# EAGLE design ATXDistributorBoard_ATM (EAGLE 7.4.0)
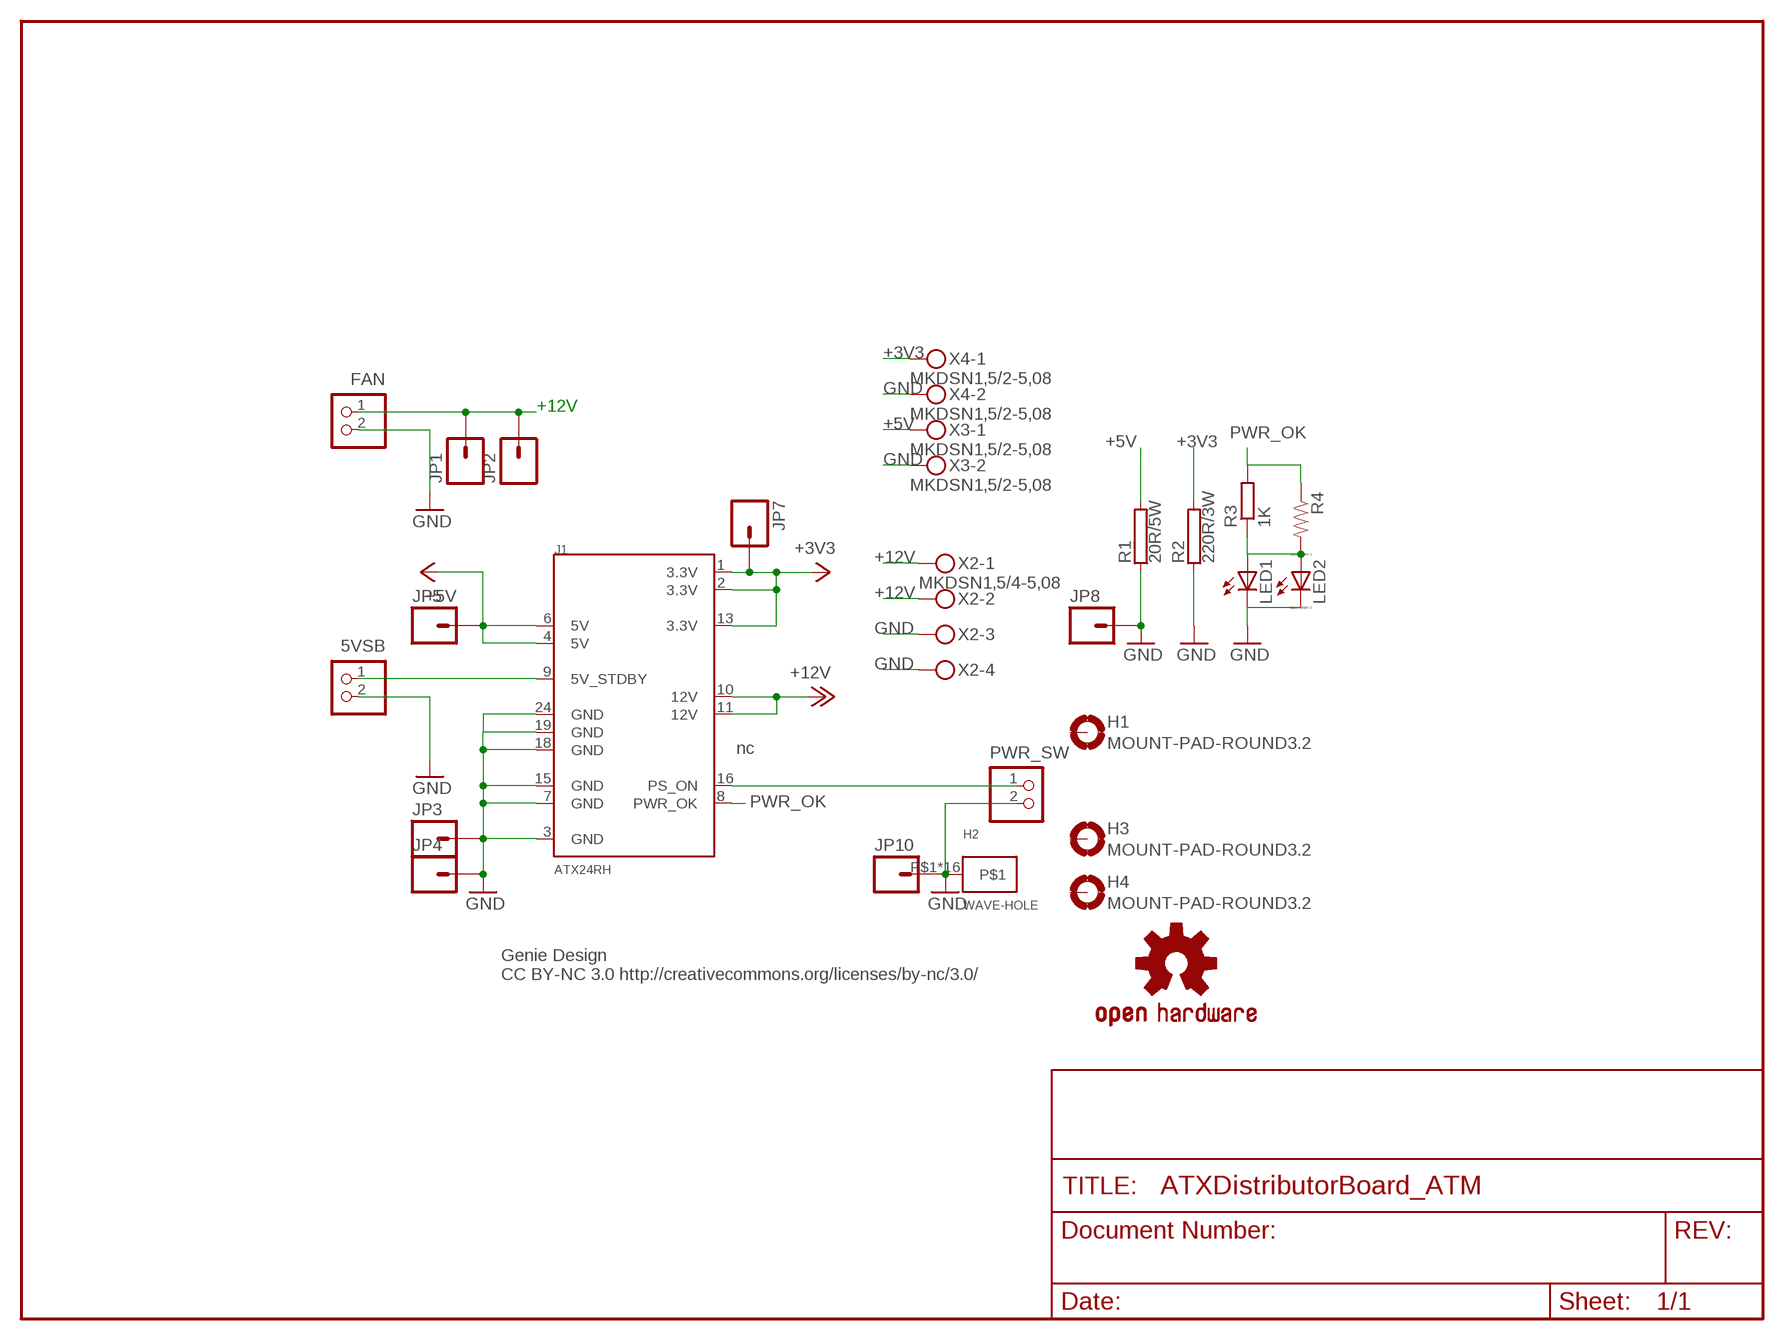
[diagram p0: schematic, sheet 1]

## Parts
5VSB  B2B-XH-A  [B2B-XH-A]
FAN  B2B-XH-A  [B2B-XH-A]
H1  MOUNT-PAD-ROUND3.2  [3,2-PAD]
H2  WAVE-HOLE  [3,0-WAVE-HOLE]
H3  MOUNT-PAD-ROUND3.2  [3,2-PAD]
H4  MOUNT-PAD-ROUND3.2  [3,2-PAD]
J1  ATX24RH  [ATX24_RIGHT_ANGLE]
JP1  M01PTH_NO_SILK_YES_STOP  [1X01_NO_SILK]
JP2  M01PTH_NO_SILK_YES_STOP  [1X01_NO_SILK]
JP3  M01PTH_NO_SILK_YES_STOP  [1X01_NO_SILK]
JP4  M01PTH_NO_SILK_YES_STOP  [1X01_NO_SILK]
JP5  M01PTH_NO_SILK_YES_STOP  [1X01_NO_SILK]
JP7  M01PTH_NO_SILK_YES_STOP  [1X01_NO_SILK]
JP8  M01PTH_NO_SILK_YES_STOP  [1X01_NO_SILK]
JP10  M01PTH_NO_SILK_YES_STOP  [1X01_NO_SILK]
LED1  LED3MM  [LED3MM]
LED2  LED_ESML0603  [LED_SML0603]
LOGO1  OSHW-LOGOS-COPPER  [OSHW-LOGO-S_COPPER]
PWR_SW  B2B-XH-A  [B2B-XH-A]
R1  20R/5W  RHPS923  [HPS923]
R2  220R/3W  RCA4050  [CA4050]
R3  1K  R-EU_0207/10  [0207/10]
R4  RESISTOR0603-RES  [0603-RES]
X2  MKDSN1,5/4-5,08  [MKDSN1,5/4-5,08]
X3  MKDSN1,5/2-5,08  [MKDSN1,5/2-5,08]
X4  MKDSN1,5/2-5,08  [MKDSN1,5/2-5,08]

## Nets
5VSB: 5VSB.1 J1.9(5V_STDBY)
+3V3: J1.1(3.3V) J1.2(3.3V) J1.13(3.3V) JP7.1 R2.2 X4.1
+5V: J1.4(5V) J1.6(5V) JP5.1 R1.2 X3.1
+12V: FAN.1 J1.10(12V) J1.11(12V) JP1.1 JP2.1 X2.1 X2.2
GND: 5VSB.2 FAN.2 H2.P$1 H2.P$2 H2.P$3 H2.P$4 H2.P$5 H2.P$6 H2.P$7 H2.P$8 H2.P$17 H2.P$18 H2.P$19 H2.P$20 H2.P$21 H2.P$22 H2.P$23 H2.P$24 J1.3(GND) J1.7(GND) J1.15(GND) J1.18(GND) J1.19(GND) J1.24(GND) JP3.1 JP4.1 JP8.1 JP10.1 LED1.K(C) LED2.C PWR_SW.2 R1.1 R2.1 X2.3 X2.4 X3.2 X4.2
N$2: LED1.A LED2.A R3.1 R4.2
PS_ON: J1.16(PS_ON) PWR_SW.1
PWR_OK: J1.8(PWR_OK) R3.2 R4.1
Unconnected: H1.B3,2(MOUNT) H3.B3,2(MOUNT) H4.B3,2(MOUNT)

## Notes on the sheet
- +12V
- nc
- Genie Design
  CC BY-NC 3.0 http://creativecommons.org/licenses/by-nc/3.0/

## Library data of the parts
5VSB FAN PWR_SW = jst-xh:B2B-XH-A: Wire-to-Board 2.5mm pitch top mount connector Source: http://www.jst-mfg.com/product/pdf/jpn/XH.pdf http://www.jst-mfg.com/product/detail.php?series=277
H1 H3 H4 = holes:MOUNT-PAD-ROUND: MOUNTING PAD, round
H2 = ultimachine:WAVE-HOLE
J1 = SparkFun-Connectors:ATX24: ATX24 Pin Power Supply Connector This is a good connector for connecting a computer power supply to a PCB. It's massive, but provides many amps of power at 5V and 12V. SKU: PRT-09498
JP1-JP5 JP7 JP8 JP10 = SparkFun-Connectors:M01: Header 1 Standard 1-pin 0.1" header. Use with straight break away headers (SKU : PRT-00116), right angle break away headers (PRT-00553), swiss pins (PRT-00743), machine pins (PRT-00117), and female headers (PRT-00115).
LED1 = led:LED: LED OSRAM: - CHIPLED LG R971, LG N971, LY N971, LG Q971, LY Q971, LO R971, LY R971 LH N974, LH R974 LS Q976, LO Q976, LY Q976 LO Q996 - Hyper CHIPLED LW Q18S LB Q993, LB Q99A, LB R99A - SideLED LS A670, LO A670, LY A670, LG A670, LP A670 LB A673, LV A673, LT A673, LW A673 LH A674 LY A675 LS A676, LA A676, LO A676, LY A676, LW A676 LS A679, LY A679, LG A679 - Hyper Micro SIDELED® LS Y876, LA Y876, LO Y876, LY Y876 LT Y87S - SmartLED LW L88C, LW L88S LB L89C, LB L89S, LG L890 LS L89K, LO L89K, LY L89K LS L896, LA L896, LO L896, LY L896 - TOPLED LS T670, LO T670, LY T670, LG T670, LP T670 LSG T670, LSP T670, LSY T670, LOP T670, LYG T670 LG T671, LOG T671, LSG T671 LB T673, LV T673, LT T673, LW T673 LH T674 LS T676, LA T676, LO T676, LY T676, LB T676, LH T676, LSB T676, LW T676 LB T67C, LV T67C, LT T67C, LS T67K, LO T67K, LY T67K, LW E67C LS E67B, LA E67B, LO E67B, LY E67B, LB E67C, LV E67C, LT E67C LW T67C LS T679, LY T679, LG T679 LS T770, LO T770, LY T770, LG T770, LP T770 LB T773, LV T773, LT T773, LW T773 LH T774 LS E675, LA E675, LY E675, LS T675 LS T776, LA T776, LO T776, LY T776, LB T776 LHGB T686 LT T68C, LB T68C - Hyper Mini TOPLED® LB M676 - Mini TOPLED Santana® LG M470 LS M47K, LO M47K, LY M47K Source: http://www.osram.convergy.de LUXEON: - LUMILED® LXK2-PW12-R00, LXK2-PW12-S00, LXK2-PW14-U00, LXK2-PW14-V00 LXK2-PM12-R00, LXK2-PM12-S00, LXK2-PM14-U00 LXK2-PE12-Q00, LXK2-PE12-R00, LXK2-PE12-S00, LXK2-PE14-T00, LXK2-PE14-U00 LXK2-PB12-K00, LXK2-PB12-L00, LXK2-PB12-M00, LXK2-PB14-N00, LXK2-PB14-P00, LXK2-PB14-Q00 LXK2-PR12-L00, LXK2-PR12-M00, LXK2-PR14-Q00, LXK2-PR14-R00 LXK2-PD12-Q00, LXK2-PD12-R00, LXK2-PD12-S00 LXK2-PH12-R00, LXK2-PH12-S00 LXK2-PL12-P00, LXK2-PL12-Q00, LXK2-PL12-R00 Source: www.luxeon.com KINGBRIGHT: KA-3528ASYC Source: www.kingbright.com
LED2 = eagle-ltspice:LED_E: LED Source: http://www.osram.convergy.de Source: www.luxeon.com Source: www.kingbright.com; SPICEMODEL: NONE; SPICEPREFIX: D; SPICETYPE: diode
LOGO1 = SparkFun-Aesthetics:OSHW-LOGO: Open Source Hardware Logo This logo indicates the piece of hardware it is found on incorporates a OSHW license and/or adheres to the definition of open source hardware found here: http://freedomdefined.org/OSHW
R1 R2 = resistor-power:R: Power Resitor; OC_FARNELL: unknown; OC_NEWARK: unknown
R3 = resistor:R-EU_: RESISTOR, European symbol
R4 = SparkFun:RESISTOR: Resistor Basic schematic elements and footprints for 0603, 1206, and PTH resistors.
X2 = con-phoenix-508:MKDSN1,5/4-5,08: MKDSN 1,5/ 4-5,08 Printklemme Nennstrom: 13,5 A Nennspannung: 250 V Rastermaß: 5,08 mm Polzahl: 4 Anschlussart: Schraubanschluss Montage: Löten Anschlussrichtung Leiter/Platine: 0 ° Artikelnummer: 1729144 Source: http://eshop.phoenixcontact.com .. 1729144.pdf; MPN: SMKDSN1,5/4-5,08; OC_FARNELL: 1792905; OC_NEWARK: 70R0300
X3 X4 = con-phoenix-508:MKDSN1,5/2-5,08: MKDSN 1,5/ 2-5,08 Printklemme Nennstrom: 13,5 A Nennspannung: 250 V Rastermaß: 5,08 mm Polzahl: 2 Anschlussart: Schraubanschluss Montage: Löten Anschlussrichtung Leiter/Platine: 0 ° Artikelnummer: 1729128 Source: http://eshop.phoenixcontact.com .. 1729128.pdf; MPN: MKDSN 1,5/2-5.08; OC_FARNELL: 1792903; OC_NEWARK: 30M2397

## Board
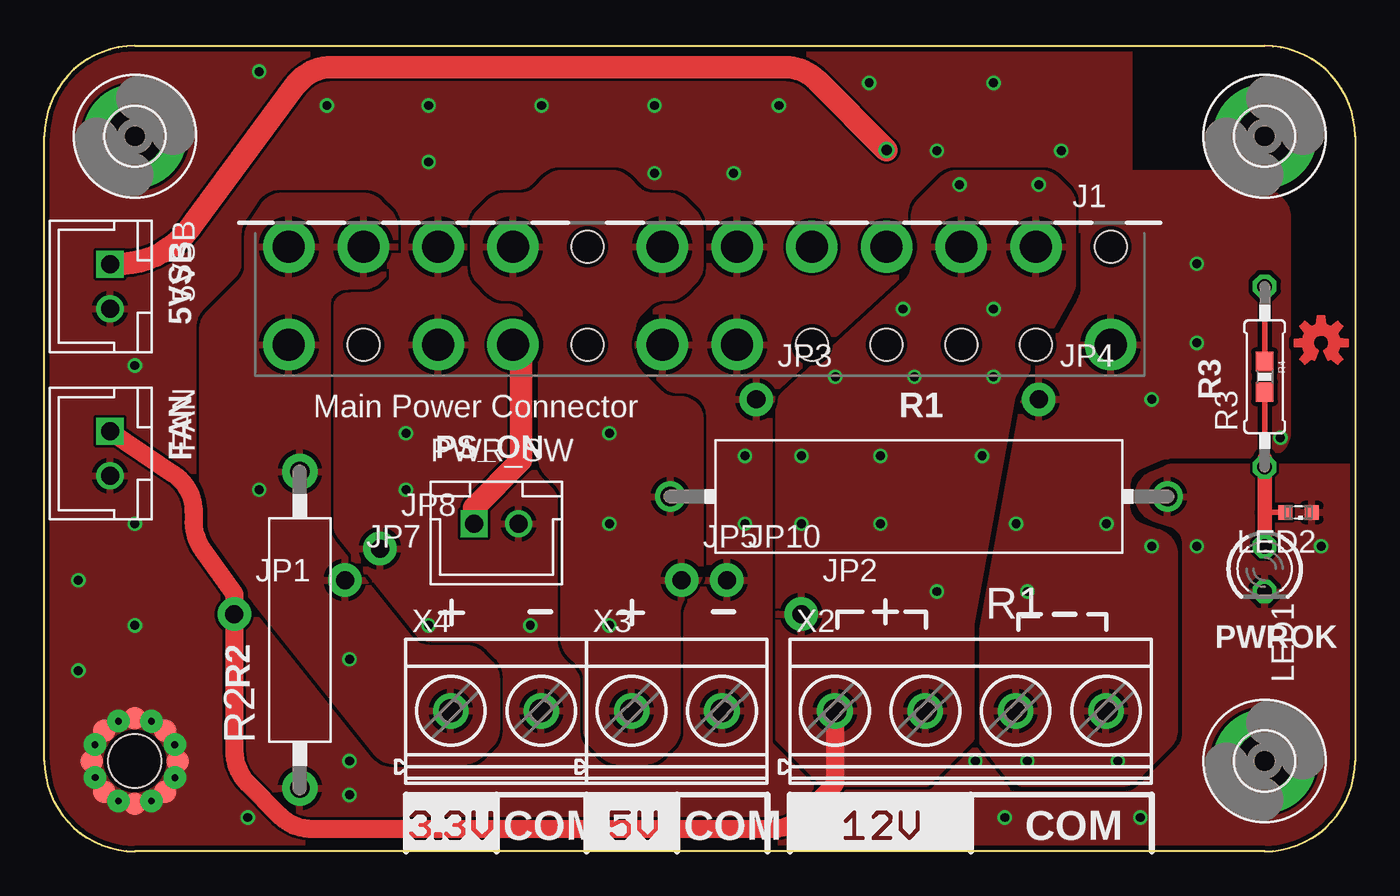
[diagram p1: board, top side]
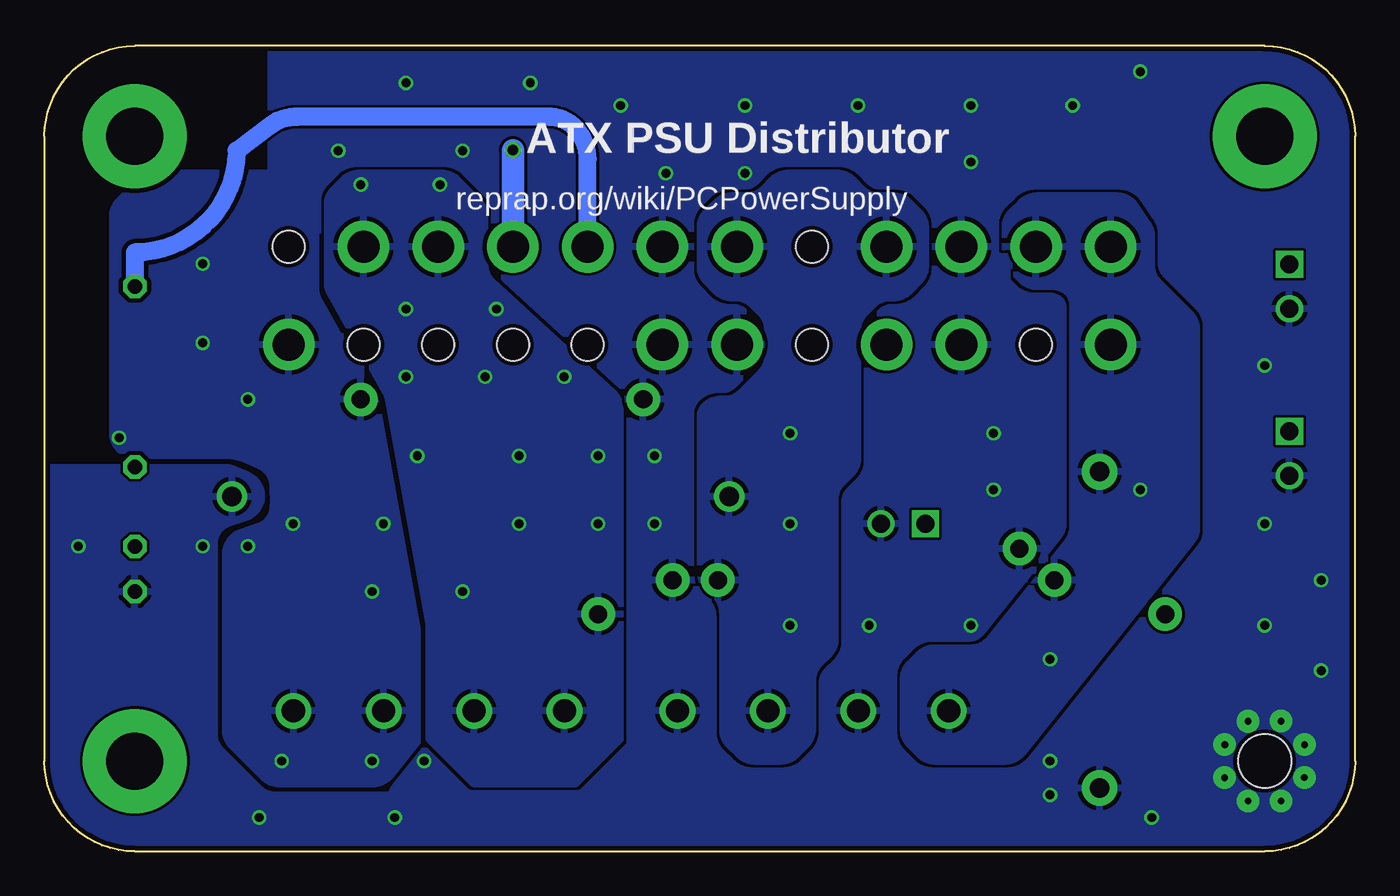
[diagram p2: board, bottom side, seen from below]

Size 73.66 x 45.26 mm. Coordinates in mm from the lower left corner, seen from the top.
Outline: 73.66,40.18 73.66,5.08 arc-90 68.58,0 5.08,0 arc-90 0,5.08 0,40.18 arc-90 5.08,45.26 68.58,45.26 arc-90 73.66,40.18
Copper layers (1*16): Top 0.035mm / dielectric 1.5mm / Bottom 0.035mm
Design rules "Elecrow_2-layer_eagle_rule": minimum track width 6mil, minimum drill 12mil, track to track 6mil, track to pad 6mil, pad to pad 6mil, via to via 6mil, smd to smd 0mil, copper to edge 10mil, drill to drill 10mil, minimum pad ring 10mil, minimum via ring 6mil, stop-mask expansion 2mil, vias tented up to drill 100mil, thermal gap 10mil

### Footprints (pad centres in the part's own frame; a part is rotated, then mirrored left to right if it is on the bottom)
B2B-XH-A = drill 1.016 square: 1 -1.25,0 | drill 1.016: 2 1.25,0
3,2-PAD = drill 3.2 pad 5.842: B3,2 0,0
3,0-WAVE-HOLE = smd 1.27 x 1.27: P$1 0,2.413; P$2 2.413,0; P$3 0,-2.413; P$4 -2.413,0; P$5 1.714,1.714; P$6 -1.714,1.714; P$7 1.714,-1.714; P$8 -1.714,-1.714 | drill 0.381 pad 1.27: P$17 -2.248,0.933; P$18 -0.927,2.242; P$19 0.921,2.242; P$20 2.235,0.927; P$21 2.242,-0.921; P$22 0.927,-2.242; P$23 -0.927,-2.235; P$24 -2.242,-0.921 | hole 3: 0,0
ATX24_RIGHT_ANGLE = drill 1.8 pad 2.9: 1 23.1,4.76; 2 18.9,4.76; 3 14.7,4.76; 4 10.5,4.76; 6 2.1,4.76; 7 -2.1,4.76; 8 -6.3,4.76; 9 -10.5,4.76; 10 -14.7,4.76; 11 -18.9,4.76; 13 23.1,10.26; 15 14.7,10.26; 16 10.5,10.26; 18 2.1,10.26; 19 -2.1,10.26; 24 -23.1,10.26 | hole 1.8: 6.3,4.76; -23.1,4.76; -18.9,10.26; -14.7,10.26; -10.5,10.26; -6.3,10.26; 6.3,10.26; 18.9,10.26
1X01_NO_SILK = drill 1.016 pad 1.88: 1 0,0
LED3MM = drill 0.813 octagon: A -1.27,0; K 1.27,0
LED_SML0603 = smd 0.8 x 0.8: A 0.75,0; C -0.75,0
HPS923 = drill 1.1 pad 1.7: 1 -13.97,0; 2 13.97,0
CA4050 = drill 1.1 pad 2: 1 -8.89,0; 2 8.89,0
0207/10 = drill 0.813 octagon: 1 -5.08,0; 2 5.08,0
0603-RES = smd 1.1 x 1: 1 -0.85,0; 2 0.85,0
MKDSN1,5/4-5,08 = drill 1.3 pad 2: 1 -7.641,0.025; 2 -2.561,0.025; 3 2.519,0.025; 4 7.599,0.025
MKDSN1,5/2-5,08 = drill 1.3 pad 2: 1 -2.561,0.025; 2 2.519,0.025

### Placement (x,y rotation side)
5VSB  3.68,31.75 270 top
FAN  3.68,22.35 270 top
H1  68.58,40.18 180 top
H2  5.08,5.08 180 top
H3  68.58,5.08 180 top
H4  5.08,40.18 180 top
J1  36.83,38.73 180 top
JP1  10.67,13.34 0 top
JP2  42.55,13.34 0 top
JP3  40.01,25.4 0 top
JP4  55.88,25.4 0 top
JP5  35.81,15.24 0 top
JP7  16.89,15.24 0 top
JP8  18.86,17.02 0 top
JP10  38.35,15.24 0 top
LED1  68.58,15.88 270 top
LED2  70.48,19.05 180 top
LOGO1  71.75,28.57 0 top
PWR_SW  25.4,18.41 0 top
R1  49.15,19.94 180 top
R2  14.35,12.45 90 top
R3  68.58,26.67 90 top
R4  68.58,26.67 270 top
X2  52.07,7.87 0 top
X3  35.56,7.87 0 top
X4  25.4,7.87 0 top

### Tracks (layer width: path | path; a pad name or v marks a point on that pad's centre or on a via)
5VSB  (via drill 0.6)
  Top 1.27: v47.33,39.41 43.42,43.33 arc45 41.62,44.07 16.14,44.07 arc53 14.1,43.04 8.38,35.31 arc-53 4.44,33.01 5VSB.1
  Bottom 1.27: v47.33,39.41 J1.9
+3V3  (via drill 0.5)
  other vias: 17.14,10.79 12.06,20.32
  pour Top (isolate 0.254): 11.64,35.24 12.32,36.26 arc-56 13.38,36.83 17.89,36.83 arc-45 18.79,36.46 19.31,35.93 arc-45 19.68,35.03 19.68,33.55 arc-45 19.31,32.65 18.79,32.12 arc-45 17.89,31.75 17.04,31.75 arc45 16.14,31.38 arc45 15.88,30.74 15.88,18.23 arc39 16.15,17.43 20.57,11.91 arc51 21.57,11.43 23.64,11.43 arc-45 24.54,11.06 25.03,10.57 arc-45 25.4,9.67 25.4,6.88 arc-45 25.03,5.98 24.5,5.45 arc-45 23.6,5.08 19.66,5.08 arc-51 18.67,5.56 9.17,17.43 arc-39 8.89,18.23 8.89,29.32 arc-45 9.26,30.22 11.06,32.01 arc45 11.43,32.91 11.43,34.54 arc-34
  pour Bottom (isolate 0.254): 11.64,35.24 12.32,36.26 arc-56 13.38,36.83 17.89,36.83 arc-45 18.79,36.46 19.31,35.93 arc-45 19.68,35.03 19.68,33.55 arc-45 19.31,32.65 18.79,32.12 arc-45 17.89,31.75 17.04,31.75 arc45 16.14,31.38 arc45 15.88,30.74 15.88,18.23 arc39 16.15,17.43 20.57,11.91 arc51 21.57,11.43 23.64,11.43 arc-45 24.54,11.06 25.03,10.57 arc-45 25.4,9.67 25.4,6.88 arc-45 25.03,5.98 24.5,5.45 arc-45 23.6,5.08 19.66,5.08 arc-51 18.67,5.56 9.17,17.43 arc-39 8.89,18.23 8.89,29.32 arc-45 9.26,30.22 11.06,32.01 arc45 11.43,32.91 11.43,34.54 arc-34
+5V  (via drill 0.5)
  other vias: 31.75,23.5 31.75,18.41 31.75,12.7
  pour Top (isolate 0.254, rank 2): 35.56,13.44 35.56,6.88 arc-45 35.19,5.98 34.66,5.45 arc-45 33.76,5.08 32.28,5.08 arc-45 31.38,5.45 30.85,5.98 arc-45 30.48,6.88 30.48,9.63 arc45 30.11,10.53 29.58,11.06 arc-45 29.21,11.96 29.21,19.79 arc45 28.84,20.69 28.31,21.22 arc-45 27.94,22.12 27.94,29.32 arc45 27.57,30.22 27.04,30.74 arc45 26.14,31.11 25.93,31.11 arc-45 25.03,31.49 24.5,32.01 arc-45 24.13,32.91 24.13,35.03 arc-45 24.5,35.93 25.03,36.46 arc-45 25.93,36.83 26.78,36.83 arc45 27.68,37.2 28.2,37.73 arc-45 29.1,38.1 31.86,38.1 arc-45 32.76,37.73 33.28,37.2 arc45 34.18,36.83 35.03,36.83 arc-45 35.93,36.46 36.46,35.93 arc-45 36.83,35.03 36.83,32.91 arc-45 36.46,32.01 35.93,31.49 arc-45 35.03,31.11 34.82,31.11 arc45 33.92,30.74 33.39,30.22 arc45 33.02,29.32 33.02,27.83 arc45 33.39,26.93 34.55,25.77 arc45 35.45,25.4 35.67,25.4 arc-45 36.57,25.03 arc-45 36.83,24.39 36.83,15.77 arc-45 36.46,14.87 35.93,14.34 arc45
  pour Bottom (isolate 0.254, rank 2): 35.56,13.44 35.56,6.88 arc-45 35.19,5.98 34.66,5.45 arc-45 33.76,5.08 32.28,5.08 arc-45 31.38,5.45 30.85,5.98 arc-45 30.48,6.88 30.48,9.63 arc45 30.11,10.53 29.58,11.06 arc-45 29.21,11.96 29.21,19.79 arc45 28.84,20.69 28.31,21.22 arc-45 27.94,22.12 27.94,29.32 arc45 27.57,30.22 27.04,30.74 arc45 26.14,31.11 25.93,31.11 arc-45 25.03,31.49 24.5,32.01 arc-45 24.13,32.91 24.13,35.03 arc-45 24.5,35.93 25.03,36.46 arc-45 25.93,36.83 26.78,36.83 arc45 27.68,37.2 28.2,37.73 arc-45 29.1,38.1 31.86,38.1 arc-45 32.76,37.73 33.28,37.2 arc45 34.18,36.83 35.03,36.83 arc-45 35.93,36.46 36.46,35.93 arc-45 36.83,35.03 36.83,32.91 arc-45 36.46,32.01 35.93,31.49 arc-45 35.03,31.11 34.82,31.11 arc45 33.92,30.74 33.39,30.22 arc45 33.02,29.32 33.02,27.83 arc45 33.39,26.93 34.55,25.77 arc45 35.45,25.4 35.67,25.4 arc-45 36.57,25.03 arc-45 36.83,24.39 36.83,15.77 arc-45 36.46,14.87 35.93,14.34 arc45
+12V  (via drill 0.5)
  Top 1.016: FAN.1 7.26,21.2 arc-56 8.38,19.09 8.38,18.47 arc36 8.86,16.99 10.67,14.48 JP1.1 10.67,5.62 arc45 11.41,3.83 13.23,2.01 arc45 15.02,1.27 40.86,1.27 arc45 42.65,2.01 44.45,3.81 44.45,7.85 arc45 X2.1
  other vias: 53.34,30.48 48.9,26.67 53.34,26.67 42.55,22.23 46.99,22.23 52.7,22.23 46.99,18.41 50.16,14.61 51.44,37.47 55.88,37.47 48.26,30.48 44.45,26.67 42.55,18.41
  pour Top (isolate 0.254): 41.27,6.31 41.27,24.84 arc-47 41.69,25.77 48.48,32.01 arc47 48.9,32.95 48.9,35.67 arc-45 49.27,36.57 50.43,37.73 arc-45 51.33,38.1 55.99,38.1 arc-45 56.89,37.73 57.41,37.2 arc-45 57.78,36.3 57.78,31.99 arc-29 57.63,31.37 54.39,25.54 52.07,12.79 52.07,6.31 49.57,3.81 43.77,3.81
  pour Bottom (isolate 0.254): 41.27,6.31 41.27,24.84 arc-47 41.69,25.77 48.48,32.01 arc47 48.9,32.95 48.9,35.67 arc-45 49.27,36.57 50.43,37.73 arc-45 51.33,38.1 55.99,38.1 arc-45 56.89,37.73 57.41,37.2 arc-45 57.78,36.3 57.78,31.99 arc-29 57.63,31.37 54.39,25.54 52.07,12.79 52.07,6.31 49.57,3.81 43.77,3.81
GND  (via drill 0.5)
  other vias: 15.88,41.91 41.27,41.91 21.59,38.73 21.59,41.91 27.94,41.91 34.29,41.91 34.29,38.1 38.73,38.1 50.16,39.37 57.15,39.37 46.35,43.18 53.34,43.18 69.47,23.24 59.69,18.41 62.23,17.14 64.77,17.14 71.75,17.14 61.59,1.91 60.33,5.08 55.24,5.08 53.98,1.91 54.61,18.41 39.37,22.23 39.37,18.41 20.32,23.5 20.32,20.32 17.14,3.17 17.14,5.08 1.91,10.16 1.91,15.24 5.08,12.7 5.08,18.41 12.06,43.81 21.59,12.7 27.3,12.7 64.77,28.57 64.77,33.02 5.08,27.3 11.43,1.91 55.24,14.61 62.23,25.4 52.32,5.08
  pour Top (isolate 0.254, rank 2): 54.19,4.29 52.35,6.6 arc-39 52.07,7.39 52.07,13.33 52.38,13.89 54.36,25.53 57.78,31.75 57.78,36.3 arc-45 58.16,37.2 58.68,37.73 arc-45 59.58,38.1 67.42,38.1 arc-45 68.32,37.73 69.48,36.57 arc-45 69.85,35.67 69.85,23.52 arc-90 68.59,22.25 63.13,22.23 arc23 62.62,22.12 61.59,21.67 arc66 60.82,20.51 60.81,19.45 arc72 61.68,18.23 62.64,17.91 arc-71 63.5,16.71 63.5,6.84 arc-45 63.13,5.94 61.37,4.18 arc-45 60.47,3.81 55.18,3.81 arc-51
  pour Top (rank 6): -0.64,-0.64 -0.64,45.72 60.96,45.72 60.96,34.92 57.15,34.92 57.15,31.75 53.72,25.53 51.44,13.34 51.55,7.04 arc38 51.84,6.27 53.95,3.65 arc-39 54.23,2.85 54.23,-0.64
  pour Top (rank 6): 74.3,21.59 63.51,21.59 arc23 63.01,21.49 62.24,21.16 arc67 61.47,19.99 61.47,19.97 arc72 62.34,18.76 63.27,18.45 arc-72 64.14,17.25 64.14,6.62 arc-45 63.76,5.72 61.59,3.55 arc-45 60.69,3.17 53.34,3.17 53.34,-0.64 74.3,-0.64
  pour Bottom (rank 6): -0.64,-0.64 -0.64,45.72 60.96,45.72 60.96,34.92 57.15,34.92 57.15,31.75 53.72,25.53 51.44,13.34 51.55,7.04 arc38 51.84,6.27 53.95,3.65 arc-39 54.23,2.85 54.23,-0.64
  pour Bottom (rank 6): 74.3,21.59 63.51,21.59 arc23 63.01,21.49 62.24,21.16 arc67 61.47,19.99 61.47,19.97 arc72 62.34,18.76 63.27,18.45 arc-72 64.14,17.25 64.14,6.62 arc-45 63.76,5.72 61.59,3.55 arc-45 60.69,3.17 53.34,3.17 53.34,-0.64 74.3,-0.64
  pour Bottom (isolate 0.254, rank 2): 54.19,4.29 52.35,6.6 arc-39 52.07,7.39 52.07,13.33 52.38,13.89 54.36,25.53 57.78,31.75 57.78,36.3 arc-45 58.16,37.2 58.68,37.73 arc-45 59.58,38.1 67.42,38.1 arc-45 68.32,37.73 69.48,36.57 arc-45 69.85,35.67 69.85,23.52 arc-90 68.59,22.25 63.13,22.23 arc23 62.62,22.12 61.59,21.67 arc66 60.82,20.51 60.81,19.45 arc72 61.68,18.23 62.64,17.91 arc-71 63.5,16.71 63.5,6.84 arc-45 63.13,5.94 61.37,4.18 arc-45 60.47,3.81 55.18,3.81 arc-51
N$2
  Top 0.254: R3.1 68.58,22.1
  Top 0.305: LED2.A 68.58,19.05 | R4.2 68.58,22.1
  Top 0.813: 68.58,22.1 68.58,19.05 LED1.A
PS_ON
  Top 0.61: J1.16 26.42,28.19
  Top 1.27: 26.42,28.19 26.8,28.19 26.8,21.97 24.15,19.32 PWR_SW.1
PWR_OK
  Top 0.305: R3.2 R4.1
  Bottom 1.016: J1.8 43.13,38.9 arc-45 43.87,40.7 arc-45 45.27,41.27 59.48,41.27 arc-37 61,40.77 62.87,39.37 arc90 68.58,33.66 R3.2

### Text on the board
tPlace: 5VSB | R3 | Main Power Connector | R1 | FAN | PS_ON | PWR | OK | R2 | COM | COM | COM
bPlace: ATX PSU Distributor | reprap.org/wiki/PCPowerSupply
tDocu: 12V2 | 3 | . | 3V | 5V | 12V1